# EAGLE design Rapide555 (EAGLE 7.7.0)
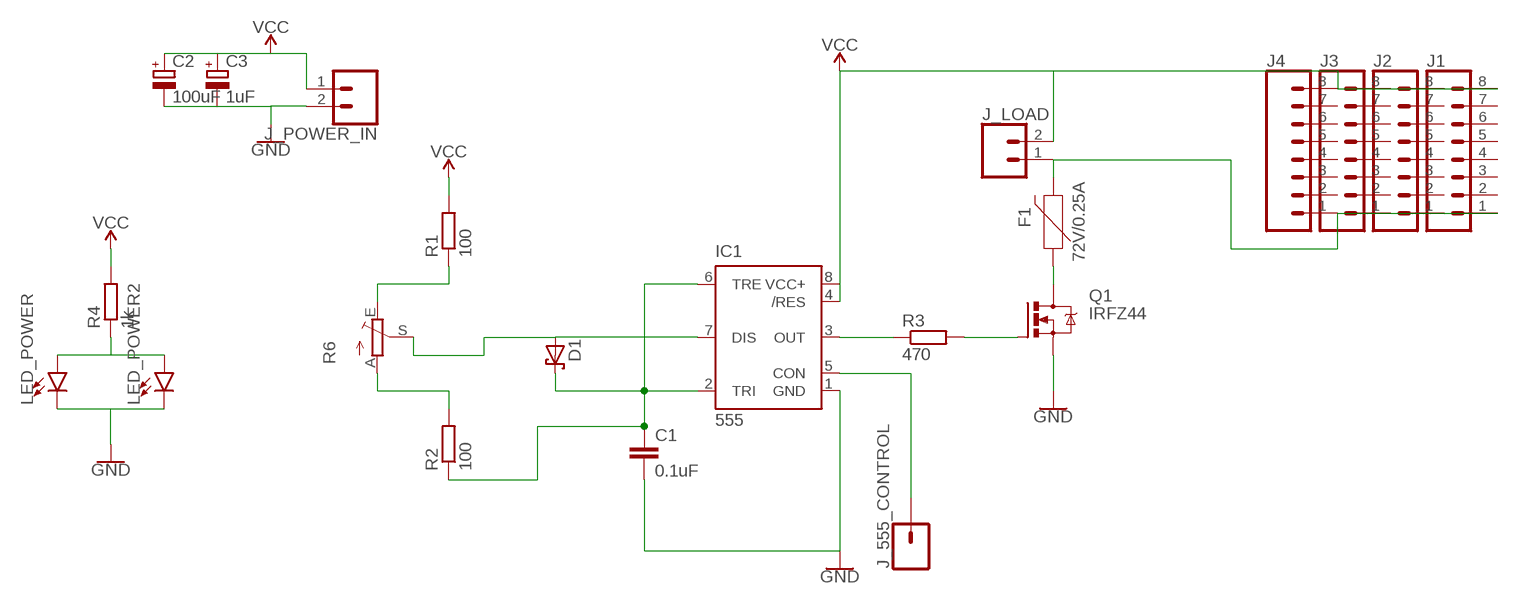
[diagram p0: schematic, sheet 1]

## Parts
C1  0.1uF  C-EU025-025X050  [C025-025X050]
C2  100uF  CPOL-EUE5-5  [E5-5]
C3  1uF  CPOL-EUE2,5-6E  [E2,5-6E]
D1  SCHOTTKY-DIODEDO35-7  [DO35-7]
F1  72V/0.25A  PPTC_PTH  [PTH]
IC1  555  555P  [DIP08]
J1  CONN_08NO_SILK_FEMALE_PTH  [1X08_NO_SILK]
J2  CONN_08NO_SILK_FEMALE_PTH  [1X08_NO_SILK]
J3  CONN_08NO_SILK_FEMALE_PTH  [1X08_NO_SILK]
J4  CONN_08NO_SILK_FEMALE_PTH  [1X08_NO_SILK]
J_555_CONTROL  CONN_01  [1X01]
J_LOAD  CONN_023.5MM  [SCREWTERMINAL-3.5MM-2]
J_POWER_IN  CONN_023.5MM  [SCREWTERMINAL-3.5MM-2]
LED_POWER  LED3MM  [LED_3MM]
LED_POWER2  LED-FKIT-1206  [FKIT-LED-1206]
Q1  IRFZ44  IXFH6N90  [TO-247AD-V]
R1  100  R-EU_0204/5  [0204/5]
R2  100  R-EU_0204/2V  [0204V]
R3  470  R-EU_0204/5  [0204/5]
R4  1k  R-EU_0204/2V  [0204V]
R6  TRIM_EU-B25P  [B25P]

## Nets
GND: C1.2 C2.- C3.- IC1.1(GND) J_POWER_IN.2 LED_POWER2.C LED_POWER.K(C) Q1.S
N$1: D1.A IC1.7(DIS) R6.S
N$2: F1.P$2 J1.1 J2.1 J3.1 J4.1 J_LOAD.1
N$3: F1.P$1 Q1.D
N$4: IC1.5(CON) J_555_CONTROL.1
N$5: IC1.3(OUT) R3.1
N$6: Q1.G R3.2
N$7: C1.1 D1.C IC1.2(TRI) IC1.6(TRE) R2.1
N$8: R1.1 R6.E
N$9: R2.2 R6.A
N$12: LED_POWER2.A LED_POWER.A R4.1
VCC: C2.+ C3.+ IC1.4(/RES) IC1.8(VCC+) J1.8 J2.8 J3.8 J4.8 J_LOAD.2 J_POWER_IN.1 R1.2 R4.2
Unconnected: J1.2 J1.3 J1.4 J1.5 J1.6 J1.7 J2.2 J2.3 J2.4 J2.5 J2.6 J2.7 J3.2 J3.3 J3.4 J3.5 J3.6 J3.7 J4.2 J4.3 J4.4 J4.5 J4.6 J4.7

## Library data of the parts
C1 = resistor:C-EU: CAPACITOR, European symbol
C2 C3 = resistor:CPOL-EU: POLARIZED CAPACITOR, European symbol
D1 = diode:SCHOTTKY-DIODE: Schottky Diode
F1 = SparkFun-Fuses:PPTC: Resettable Fuse PPTC Resettable Fuse. Really a sort of resistor with a polymeric positive temperature coefficient whose resistance increases dramatically with an increase in temperature. When heated by the power passing through the resistance rises causing the current to be limited, protecting the circuit. This is achieved by the transition of the polymer from a crystalline to an amorphous state where the conductive carbon separates breaking the conductive pathways found in the cool crystalline structure. When a PPTC cools back down it resumes conducting letting the circuit turn back on. SparkFun Products: SparkFun RedBoard - Programmed with Arduino <https://www.sparkfun.com/products/12757> Pro Micro - 5V/16MHz <https://www.sparkfun.com/products/12640> Arduino Pro 328 - 5V/16MHz <https://www.sparkfun.com/products/10915> MP3 Trigger <https://www.sparkfun.com/products/13720>; PROD_ID: RES-08490
IC1 = SparkFun-IC-Special-Function:555: General purpose bipolar Timer Datasheet <http://www.sparkfun.com/datasheets/Components/General/ne555.pdf> SparkFun Products SparkFun SparkPunk Sequencer Kit <https://www.sparkfun.com/products/12707> (KIT-12707) Storefront Component: 555 Timer <https://www.sparkfun.com/products/9273> (COM-09273) Two parts valid for production: VFP: IC-11930 (M7555 PTH) VFP: IC-09173 (555 PTH) - Preferred; PROD_ID: IC-09173; PROD_ID_ALT: IC-09173
J1-J4 = SparkFun-Connectors:CONN_08: Multi connection point. Often used as Generic Header-pin footprint for 0.1 inch spaced/style header connections On any of the 0.1 inch spaced packages, you can populate with these: Break Away Headers - Straight <https://www.sparkfun.com/products/116> (PRT-00116) Break Away Male Headers - Right Angle <https://www.sparkfun.com/products/553> (PRT-00553) Female Headers <https://www.sparkfun.com/products/115> (PRT-00115) Break Away Headers - Machine Pin <https://www.sparkfun.com/products/117> (PRT-00117) Break Away Female Headers - Swiss Machine Pin <https://www.sparkfun.com/products/743> (PRT-00743) Arduino Stackable Header - 8 Pin <https://www.sparkfun.com/products/9279> (PRT-09279) For SCREWTERMINALS and SPRING TERMINALS visit here: Screw Terimnals on SparkFun.com <https://www.sparkfun.com/search/results?term=Screw+Terminals> (5mm/3.5mm/2.54mm spacing) This device is also useful as a general connection point to wire up your design to another part of your project. Our various solder wires solder well into these plated through hole pads. Hook-Up Wire - Assortment (Stranded, 22 AWG) <https://www.sparkfun.com/products/11375> (PRT-11375) Hook-Up Wire - Assortment (Solid Core, 22 AWG) <https://www.sparkfun.com/products/11367> (PRT-11367) View the entire wire category on our website here <https://www.sparkfun.com/categories/141> Special notes: Molex polarized connector foot print use with SKU : PRT-08231 with associated crimp pins and housings. 1MM SMD Version SKU: PRT-10208 NOTES ON THE VARIANTS LOCK and LOCK_LONGPADS... This footprint was designed to help hold the alignment of a through-hole component (i.e. 6-pin header) while soldering it into place. You may notice that each hole has been shifted either up or down by 0.005 of an inch from it's more standard position (which is a perfectly straight line). This slight alteration caused the pins (the squares in the middle) to touch the edges of the holes. Because they are alternating, it causes a "brace" to hold the component in place. 0.005 has proven to be the perfect amount of "off-center" position when using our standard breakaway headers. Although looks a little odd when you look at the bare footprint, once you have a header in there, the alteration is very hard to notice. Also,if you push a header all the way into place, it is covered up entirely on the bottom side.; PROD_ID: CONN-08438
J_555_CONTROL = SparkFun-Connectors:CONN_01: Single connection point. Often used as Generic Header-pin footprint for 0.1 inch spaced/style header connections On any of the 0.1 inch spaced packages, you can populate with these: Break Away Headers - Straight <https://www.sparkfun.com/products/116> (PRT-00116) Break Away Male Headers - Right Angle <https://www.sparkfun.com/products/553> (PRT-00553) Female Headers <https://www.sparkfun.com/products/115> (PRT-00115) Break Away Headers - Machine Pin <https://www.sparkfun.com/products/117> (PRT-00117) Break Away Female Headers - Swiss Machine Pin <https://www.sparkfun.com/products/743> (PRT-00743) This device is also useful as a general connection point to wire up your design to another part of your project. Our various solder wires solder well into these plated through hole pads. Hook-Up Wire - Assortment (Stranded, 22 AWG) <https://www.sparkfun.com/products/11375> (PRT-11375) Hook-Up Wire - Assortment (Solid Core, 22 AWG) <https://www.sparkfun.com/products/11367> (PRT-11367) View the entire wire category on our website here <https://www.sparkfun.com/categories/141> Special notes: SMTSO-256-ET is a "flush mount" nut for a 4-40 screw. We mostly use this on specialty testbeds; it is a nice way to connect hardware to your PCB at an adjustable hieght. Also note, the SNAP packages are for using a snappable style connector. We sell a baggie of snaps and they are also used on two LilyPad designs: Snap Assortment - 30 pack (male and female) <https://www.sparkfun.com/products/11347> (DEV-11347) LilyPad Arduino SimpleSnap <https://www.sparkfun.com/products/10941> (DEV-10941) LilyPad SimpleSnap Protoboard <https://www.sparkfun.com/products/10940> (DEV-10940)
J_LOAD J_POWER_IN = SparkFun-Connectors:CONN_02: Multi connection point. Often used as Generic Header-pin footprint for 0.1 inch spaced/style header connections On any of the 0.1 inch spaced packages, you can populate with these: Break Away Headers - Straight <https://www.sparkfun.com/products/116> (PRT-00116) Break Away Male Headers - Right Angle <https://www.sparkfun.com/products/553> (PRT-00553) Female Headers <https://www.sparkfun.com/products/115> (PRT-00115) Break Away Headers - Machine Pin <https://www.sparkfun.com/products/117> (PRT-00117) Break Away Female Headers - Swiss Machine Pin <https://www.sparkfun.com/products/743> (PRT-00743) For SCREWTERMINALS and SPRING TERMINALS visit here: Screw Terimnals on SparkFun.com <https://www.sparkfun.com/search/results?term=Screw+Terminals> (5mm/3.5mm/2.54mm spacing) This device is also useful as a general connection point to wire up your design to another part of your project. Our various solder wires solder well into these plated through hole pads. Hook-Up Wire - Assortment (Stranded, 22 AWG) <https://www.sparkfun.com/products/11375> (PRT-11375) Hook-Up Wire - Assortment (Solid Core, 22 AWG) <https://www.sparkfun.com/products/11367> (PRT-11367) View the entire wire category on our website here <https://www.sparkfun.com/categories/141> Special notes: Molex polarized connector foot print use with: PRT-08233 with associated crimp pins and housings. 2.54_SCREWTERM for use with PRT-10571. 3.5mm Screw Terminal footprints for PRT-08084 5mm Screw Terminal footprints for use with PRT-08432; PROD_ID: CONN-08399
LED_POWER = SparkFun-LED:LED: LED (Generic) Standard schematic elements and footprints for 5mm, 3mm, 1206, and 0603 sized LEDs. Generic LEDs with no color specified.; PROD_ID: DIO-08794
LED_POWER2 = SparkFun-LED:LED: LED (Generic) Standard schematic elements and footprints for 5mm, 3mm, 1206, and 0603 sized LEDs. Generic LEDs with no color specified.
Q1 = transistor-power:IXF?6N*: HiPerFET (TM) Power MOSFET N-Channel Enhancement Mode HDMOS Family Source: http://www.ixys.com/91529.pdf
R1-R4 = resistor:R-EU_: RESISTOR, European symbol
R6 = pot:TRIM_EU-: POTENTIOMETER

## Board
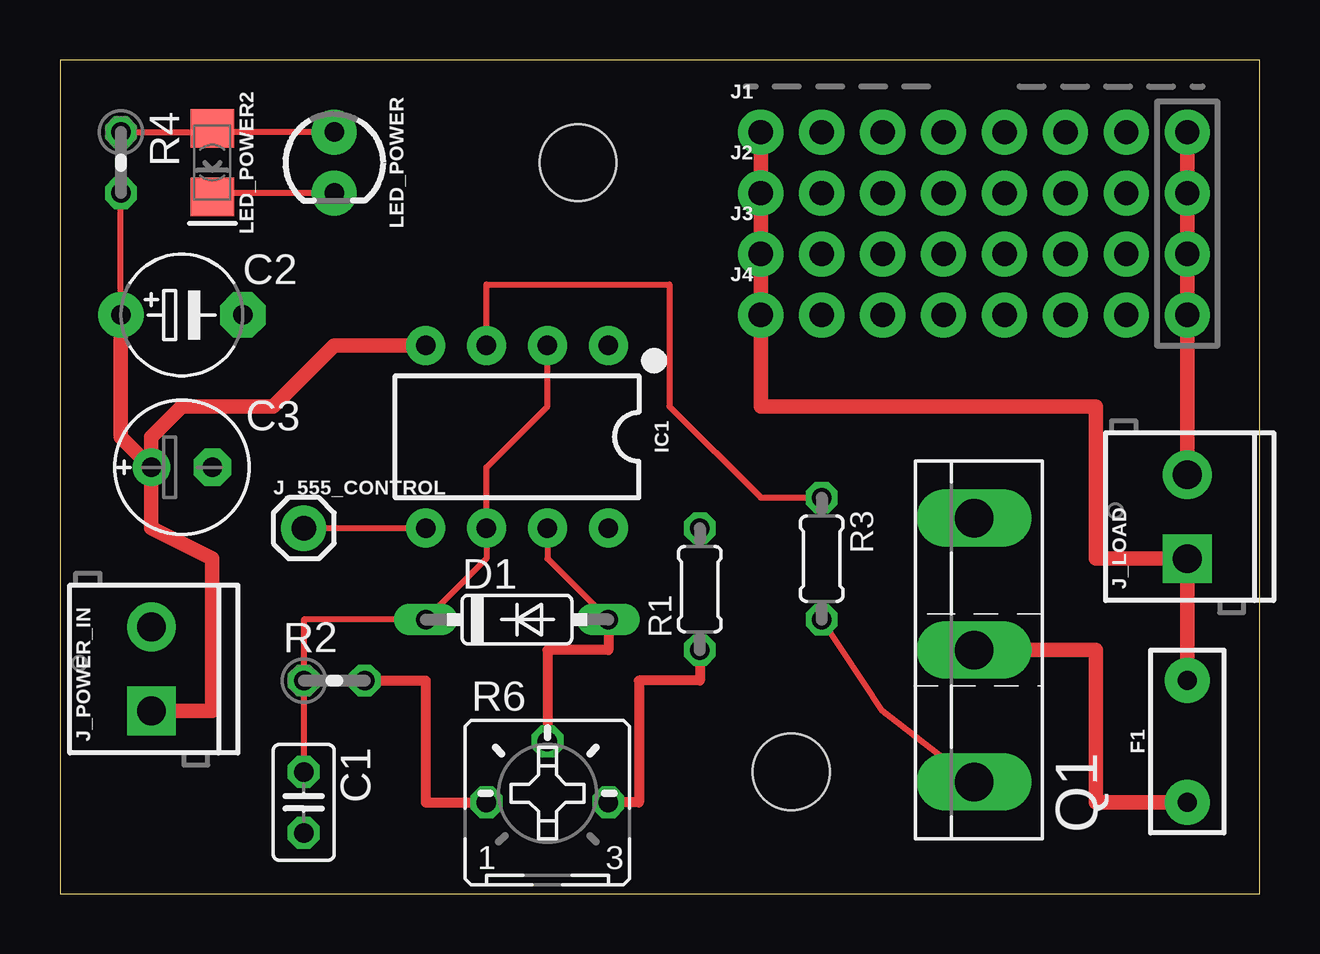
[diagram p1: board, top side]
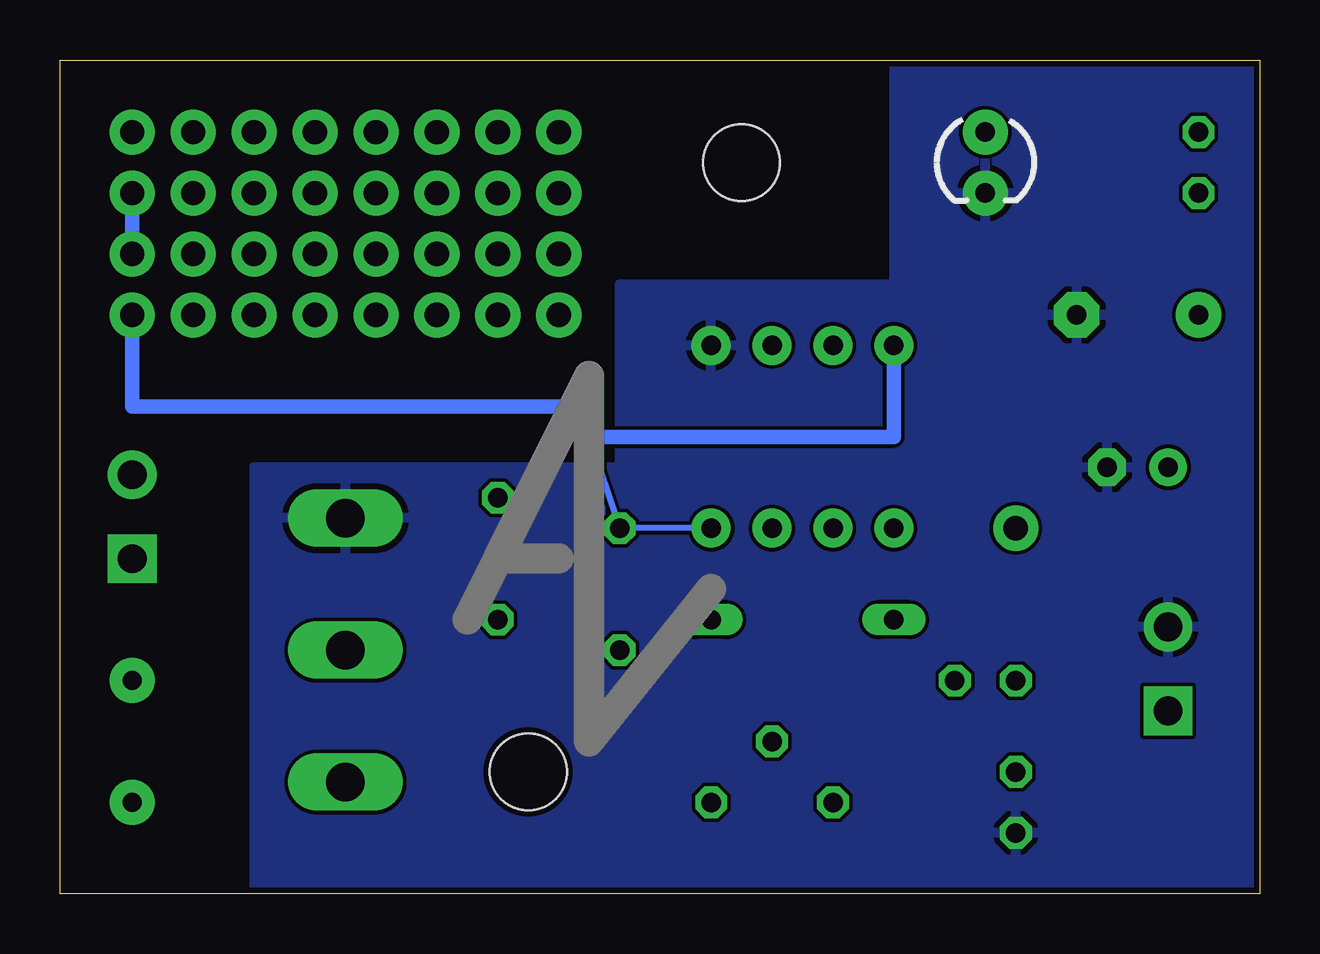
[diagram p2: board, bottom side, seen from below]

Size 50 x 34.76 mm. Coordinates in mm from the lower left corner, seen from the top.
Outline: 0,0 50,0 50,34.76 0,34.76 0,0
Copper layers (1*16): Top 0.035mm / dielectric 1.5mm / Bottom 0.035mm
Design rules "SeeedStudio_2layer_DRU_no_angle_20140221": minimum track width 6mil, minimum drill 12mil, track to track 6mil, track to pad 6mil, pad to pad 6mil, via to via 6mil, smd to smd 0mil, copper to edge 10mil, drill to drill 10mil, minimum pad ring 10mil, minimum via ring 6mil, stop-mask expansion 2mil, vias tented up to drill 100mil, thermal gap 10mil
Holes 3.2 mm at 21.59,30.48 30.48,5.08

### Footprints (pad centres in the part's own frame; a part is rotated, then mirrored left to right if it is on the bottom)
C025-025X050 = drill 0.813 octagon: 1 -1.27,0; 2 1.27,0
E5-5 = drill 0.813 pad 1.905: + -2.54,0 | drill 0.813 pad 1.905 octagon: - 2.54,0
E2,5-6E = drill 0.813 pad 1.575: + -1.27,0 | drill 0.813 pad 1.575 octagon: - 1.27,0
DO35-7 = drill 0.813 long: A 3.81,0; C -3.81,0
PTH = drill 0.8 pad 1.88: P$1 -2.54,0; P$2 2.54,0
DIP08 = drill 0.813 pad 1.626: 1 -3.81,-3.81; 2 -1.27,-3.81; 3 1.27,-3.81; 4 3.81,-3.81; 5 3.81,3.81; 6 1.27,3.81; 7 -1.27,3.81; 8 -3.81,3.81
1X08_NO_SILK = drill 1.016 pad 1.88: 1 0,0; 2 2.54,0; 3 5.08,0; 4 7.62,0; 5 10.16,0; 6 12.7,0; 7 15.24,0; 8 17.78,0
1X01 = drill 1.016 pad 1.88: 1 0,0
SCREWTERMINAL-3.5MM-2 = drill 1.2 pad 2.032 square: 1 0,0 | drill 1.2 pad 2.032: 2 3.5,0
LED_3MM = drill 0.813 pad 1.88: A -1.27,0; K 1.27,0
FKIT-LED-1206 = smd 1.6 x 1.803: A -1.422,0; C 1.422,0
TO-247AD-V = drill 1.6 long: D 0,-2.54; G -5.5,-2.54; S 5.5,-2.54
0204/5 = drill 0.813 octagon: 1 -2.54,0; 2 2.54,0
0204V = drill 0.813 octagon: 1 -1.27,0; 2 1.27,0
B25P = drill 0.813 octagon: A -2.54,0; E 2.54,0; S 0,2.54

### Placement (x,y rotation side)
C1  10.16,3.81 270 top
C2  5.08,24.13 0 top
C3  5.08,17.78 0 top
D1  19.05,11.43 0 top
F1  46.99,6.35 90 top
IC1  19.05,19.05 180 top
J1  29.21,31.75 0 top
J2  29.21,29.21 0 top
J3  29.21,26.67 0 top
J4  29.21,24.13 0 top
J_555_CONTROL  10.16,15.24 0 top
J_LOAD  46.99,13.97 90 top
J_POWER_IN  3.81,7.62 90 top
LED_POWER  11.43,30.48 270 top
LED_POWER2  6.35,30.48 270 top
Q1  35.56,10.16 90 top
R1  26.67,12.7 90 top
R2  11.43,8.89 0 top
R3  31.75,13.97 270 top
R4  2.54,30.48 270 top
R6  20.32,3.81 0 top

### Tracks (layer width: path | path; a pad name or v marks a point on that pad's centre or on a via)
GND
  Top 0.254: LED_POWER.K 6.35,29.21 LED_POWER2.C
  pour Bottom: -2.54,36.83 15.24,36.83 15.24,25.4 26.67,25.4 26.67,17.78 41.91,17.78 41.91,-1.27 -2.54,-1.27
N$1
  Top 0.254: D1.A 20.32,13.97 IC1.7
  Top 0.406: D1.A 22.86,10.16 20.32,10.16 R6.S
N$2
  Top 0.61: F1.P$2 J_LOAD.1 43.18,13.97 43.18,20.32 29.21,20.32 J4.1 J3.1 J2.1 J1.1
N$3
  Top 0.61: F1.P$1 43.18,3.81 43.18,10.16 Q1.D
N$4
  Top 0.254: J_555_CONTROL.1 IC1.5
N$5
  Top 0.254: R3.1 29.21,16.51 25.4,20.32 25.4,25.4 17.78,25.4 IC1.3
N$6
  Top 0.254: R3.2 34.29,7.62 Q1.G
N$7
  Top 0.254: C1.1 R2.1 10.16,11.43 D1.C 17.78,13.97 IC1.6 17.78,17.78 20.32,20.32 IC1.2
N$8
  Top 0.406: R1.1 26.67,8.89 24.13,8.89 24.13,3.81 R6.E
N$9
  Top 0.406: R2.2 15.24,8.89 15.24,3.81 R6.A
N$12
  Top 0.254: R4.1 6.35,31.75 | LED_POWER.A 6.35,31.75 | 6.35,31.75 LED_POWER2.A
VCC
  Top 0.254: C2.+ R4.2
  Top 0.61: C3.+ 2.54,19.05 C2.+ | IC1.4 11.43,22.86 8.89,20.32 5.08,20.32 3.81,19.05 C3.+ | J_POWER_IN.1 6.35,7.62 6.35,13.97 3.81,15.24 C3.+ | J1.8 J2.8 J3.8 J4.8 J_LOAD.2
  Bottom 0.254: IC1.8 R1.2 27.94,19.05
  Bottom 0.61: J3.8 J2.8 | J4.8 46.99,20.32 29.21,20.32 27.94,19.05 15.24,19.05 IC1.4

### Text on the board
tDocu: PWM | PWM555 | GND | VCC | 555
bDocu: v1.0 (Sept 2017) | http://electrogeek.cc/rapide555.html